# Altium schematic sheet I2C_bueses.SchDoc: I2C buses
size Letter
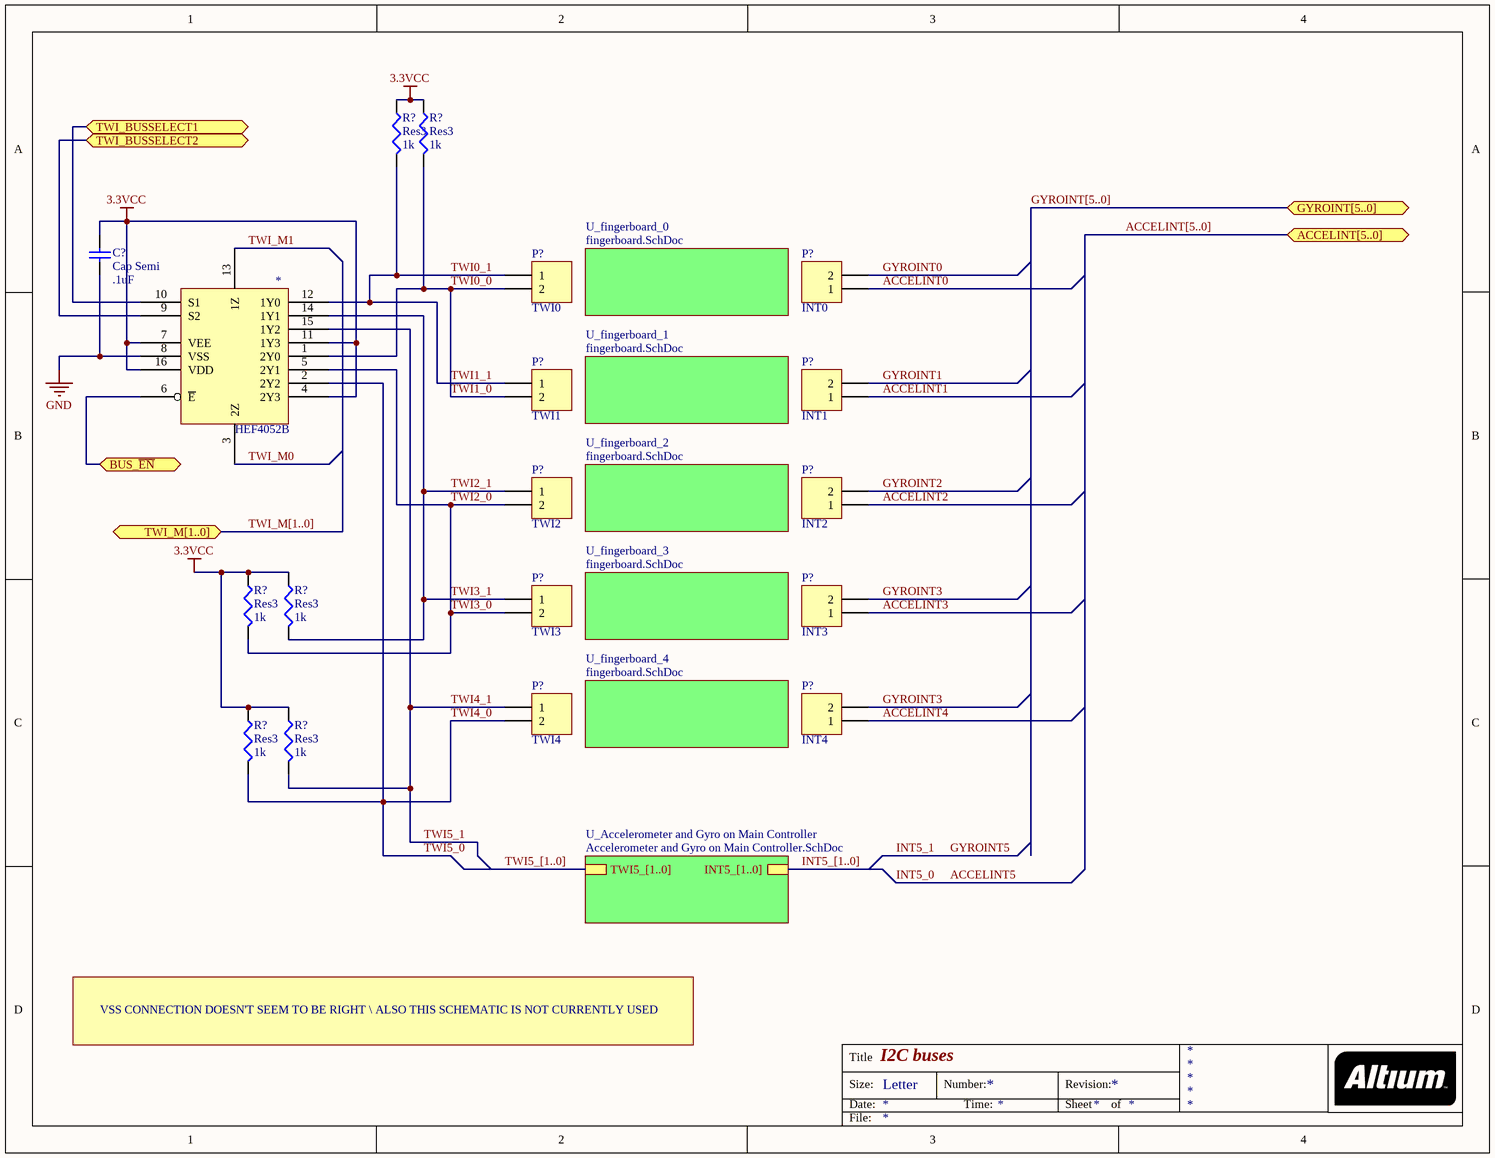
[diagram p0: I2C_bueses.SchDoc]

## Parts
(Parts that share a designator on the sheet are numbered #1, #2 ... from top to bottom, then left to right.)
*  HEF4052B  [SO16_M]
C?  Cap Semi  value .1uF  [C1206]
P?#1  TWI0  [HDR1X2]
P?#2  INT0  [HDR1X2]
P?#3  TWI1  [HDR1X2]
P?#4  INT1  [HDR1X2]
P?#5  TWI2  [HDR1X2]
P?#6  INT2  [HDR1X2]
P?#7  TWI3  [HDR1X2]
P?#8  INT3  [HDR1X2]
P?#9  TWI4  [HDR1X2]
P?#10  INT4  [HDR1X2]
R?#1  Res3  value 1k  [C0805]
R?#2  Res3  value 1k  [C0805]
R?#3  Res3  value 1k  [C0805]
R?#4  Res3  value 1k  [C0805]
R?#5  Res3  value 1k  [C0805]
R?#6  Res3  value 1k  [C0805]

## Sub-sheets
U_Accelerometer and Gyro on Main Controller = Accelerometer and Gyro on Main Controller.SchDoc: TWI5_[1..0], INT5_[1..0]
U_fingerboard_0 = fingerboard.SchDoc: no entries
U_fingerboard_1 = fingerboard.SchDoc: no entries
U_fingerboard_2 = fingerboard.SchDoc: no entries
U_fingerboard_3 = fingerboard.SchDoc: no entries
U_fingerboard_4 = fingerboard.SchDoc: no entries

## Ports
ACCELINT[5..0], BUS_~{EN}, GYROINT[5..0], TWI_BUSSELECT1, TWI_BUSSELECT2, TWI_M[1..0]

## Nets
3.3VCC: *.4(2Y3) *.7(VEE) *.11(1Y3) *.16(VDD) C?.2 R?#1.1 R?#2.1 R?#3.1 R?#4.1 R?#5.1 R?#6.1
GND: *.8(VSS) C?.1
ACCELINT0: P?#2.1
ACCELINT1: P?#4.1
ACCELINT2: P?#6.1
ACCELINT3: P?#8.1
ACCELINT4: P?#10.1
BUS_~{EN}: *.6(~{E}) ; port BUS_~{EN}
GYROINT0: P?#2.2
GYROINT1: P?#4.2
GYROINT2: P?#6.2
GYROINT3: P?#8.2 P?#10.2
TWI0_0: *.1(2Y0) *.12(1Y0) P?#1.1 P?#1.2 P?#3.1 P?#3.2 R?#1.2 R?#2.2  [also labelled TWI0_1, TWI1_0, TWI1_1]
TWI2_0: *.5(2Y1) *.14(1Y1) P?#5.1 P?#5.2 P?#7.1 P?#7.2 R?#3.2 R?#4.2  [also labelled TWI2_1, TWI3_0, TWI3_1]
TWI4_0: *.2(2Y2) P?#9.2 R?#5.2  [also labelled TWI5_0]
TWI4_1: *.15(1Y2) P?#9.1 R?#6.2  [also labelled TWI5_1]
TWI_BUSSELECT1: *.10(S1) ; port TWI_BUSSELECT1
TWI_BUSSELECT2: *.9(S2) ; port TWI_BUSSELECT2
TWI_M0: *.3(2Z)
TWI_M1: *.13(1Z)

## Buses and harness runs
bus ACCELINT[5..0] = port ACCELINT[5..0]
bus GYROINT[5..0] = port GYROINT[5..0]
bus INT5_[1..0] = sheet U_Accelerometer and Gyro on Main Controller/INT5_[1..0]
bus TWI5_[1..0] = sheet U_Accelerometer and Gyro on Main Controller/TWI5_[1..0]
bus TWI_M[1..0] = port TWI_M[1..0]

## Notes on the sheet
- VSS CONNECTION DOESN'T SEEM TO BE RIGHT \ ALSO THIS SCHEMATIC IS NOT CURRENTLY USED
- Title
- Size:
- Date:
- Letter
- Number:
- Time:
- Revision:
- Sheet
- of
- File:

## Library data of the parts
C? = Cap Semi: Capacitor (Semiconductor SIM Model); Published: 8-Jun-2000; LatestRevisionDate: 29-May-2009; LatestRevisionNote: IPC-7351 Footprint Added.; PackageReference: C1206; Publisher: Altium Limited; PackageDescription: Chip Capacitor
P?#1-P?#10 = Header 2: Header, 2-Pin; LatestRevisionDate: 17-Jul-2002; LatestRevisionNote: Re-released for DXP Platform.; Publisher: Altium Limited
R?#1-R?#6 = Res3: Resistor; Published: 8-Jun-2000; LatestRevisionDate: 29-May-2009; LatestRevisionNote: IPC-7351 Footprint Added.; PackageReference: J1-0603; Publisher: Altium Limited; PackageDescription: Chip Resistor